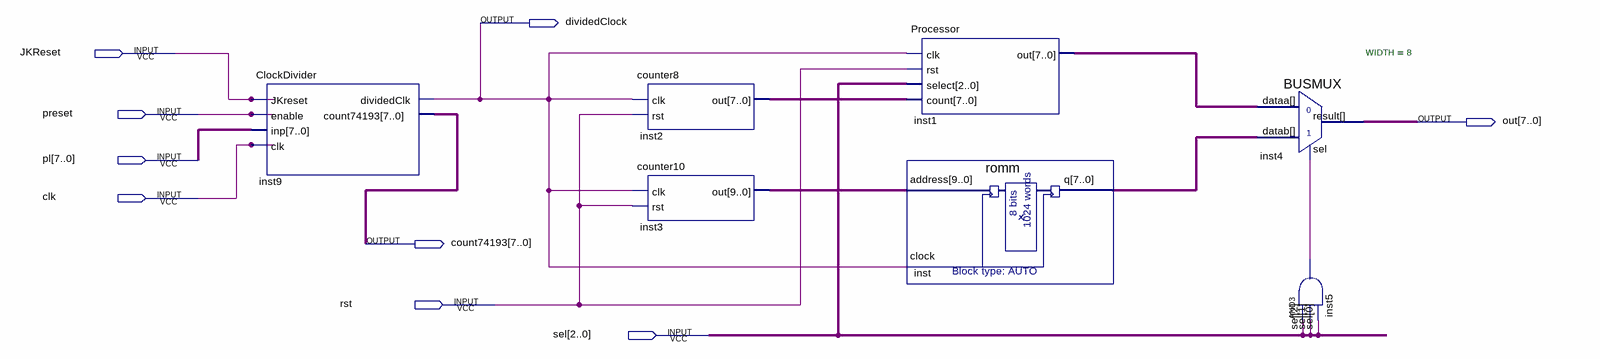
[diagram p0: schematic sheet]
// Quartus schematic FuncGenWithFreqSel.bdf as structural Verilog: 7 symbols, 9 pins
module FuncGenWithFreqSel (
  input  JKReset,
  input  preset,
  input  [7:0] pl,
  input  clk,
  input  rst,
  input  [2:0] sel,
  output dividedClock,
  output [7:0] out,
  output [7:0] count74193
);

  wire inst5_out;
  wire [7:0] inst1_out, inst2_out, inst_q;
  wire [9:0] inst3_out;

  ClockDivider inst9 (
    .JKreset(JKReset), .enable(preset), .inp(pl), .clk(clk), .dividedClk(dividedClock),
    .count74193(count74193));
  counter8 inst2 (.clk(dividedClock), .rst(rst), .out(inst2_out));
  counter10 inst3 (.clk(dividedClock), .rst(rst), .out(inst3_out));
  Processor inst1 (.clk(dividedClock), .rst(rst), .select(sel), .count(inst2_out), .out(inst1_out));
  romm inst (.address(inst3_out), .clock(dividedClock), .q(inst_q));
  BUSMUX #(.WIDTH(8)) inst4 (.datab(inst_q), .sel(inst5_out), .dataa(inst1_out), .result(out));
  and inst5 (inst5_out, sel[2], sel[1], sel[0]);
endmodule
